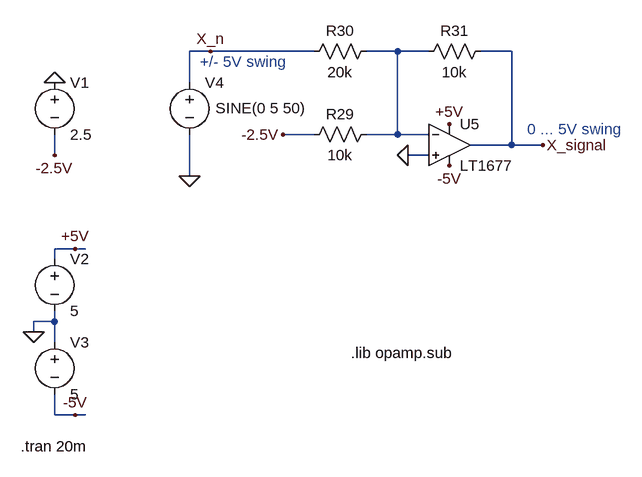
[diagram p0: schematic single_ended_ADC_driver.asc]
single_ended_ADC_driver.asc, the LTspice schematic file:
Version 4
SHEET 1 880 680
WIRE -128 -192 -160 -192
WIRE 32 -192 -128 -192
WIRE 160 -192 112 -192
WIRE 208 -192 160 -192
WIRE 336 -192 288 -192
WIRE -160 -144 -160 -192
WIRE 32 -64 -16 -64
WIRE 160 -64 160 -192
WIRE 160 -64 112 -64
WIRE 208 -64 160 -64
WIRE 336 -48 336 -192
WIRE 336 -48 272 -48
WIRE 384 -48 336 -48
WIRE -368 -32 -368 -64
WIRE 208 -32 176 -32
WIRE -160 0 -160 -64
WIRE -336 112 -368 112
WIRE -320 112 -336 112
WIRE -368 128 -368 112
WIRE -368 224 -368 208
WIRE -368 224 -400 224
WIRE -400 240 -400 224
WIRE -368 256 -368 224
WIRE -368 368 -368 336
WIRE -336 368 -368 368
WIRE -320 368 -336 368
FLAG -400 240 0
FLAG -336 112 +5V
FLAG -336 368 -5V
FLAG 240 -16 -5V
FLAG 240 -80 +5V
FLAG -368 -144 0
FLAG -368 -32 -2.5V
FLAG -16 -64 -2.5V
FLAG 176 -32 0
FLAG -160 0 0
FLAG 384 -48 X_signal
FLAG -128 -192 X_n
SYMBOL OpAmps\\LT1677 240 -112 R0
SYMATTR InstName U5
SYMBOL voltage -368 -160 R0
WINDOW 123 0 0 Left 0
WINDOW 39 0 0 Left 0
SYMATTR InstName V1
SYMATTR Value 2.5
SYMBOL voltage -368 112 R0
WINDOW 123 0 0 Left 0
WINDOW 39 0 0 Left 0
SYMATTR InstName V2
SYMATTR Value 5
SYMBOL voltage -368 240 R0
WINDOW 123 0 0 Left 0
WINDOW 39 0 0 Left 0
SYMATTR InstName V3
SYMATTR Value 5
SYMBOL res 128 -80 R90
WINDOW 0 0 56 VBottom 2
WINDOW 3 32 56 VTop 2
SYMATTR InstName R29
SYMATTR Value 10k
SYMBOL res 304 -208 R90
WINDOW 0 0 56 VBottom 2
WINDOW 3 32 56 VTop 2
SYMATTR InstName R31
SYMATTR Value 10k
SYMBOL res 128 -208 R90
WINDOW 0 0 56 VBottom 2
WINDOW 3 32 56 VTop 2
SYMATTR InstName R30
SYMATTR Value 20k
SYMBOL voltage -160 -160 R0
WINDOW 3 40 55 Left 2
WINDOW 123 0 0 Left 0
WINDOW 39 0 0 Left 0
SYMATTR InstName V4
SYMATTR Value SINE(0 5 50)
TEXT 88 272 Left 2 !.lib opamp.sub
TEXT -420 416 Left 2 !.tran 20m
TEXT -144 -176 Left 2 ;+/- 5V swing
TEXT 360 -72 Left 2 ;0 ... 5V swing

The netlist it stands for:
* single_ended_ADC_driver.asc
XU5 0 N001 +5V -5V X_signal LT1677  ; pins In+ In- V+ V- OUT
V1 0 -2.5V 2.5
V2 +5V 0 5
V3 0 -5V 5
R29 N001 -2.5V 10k
R31 X_signal N001 10k
R30 N001 X_n 20k
V4 X_n 0 SINE(0 5 50)
.lib opamp.sub
.tran 20m
* +/- 5V swing
* 0 ... 5V swing
.lib LTC.lib
.backanno
.end